# EAGLE schematic one-sided-keytile (EAGLE 9.5.1)
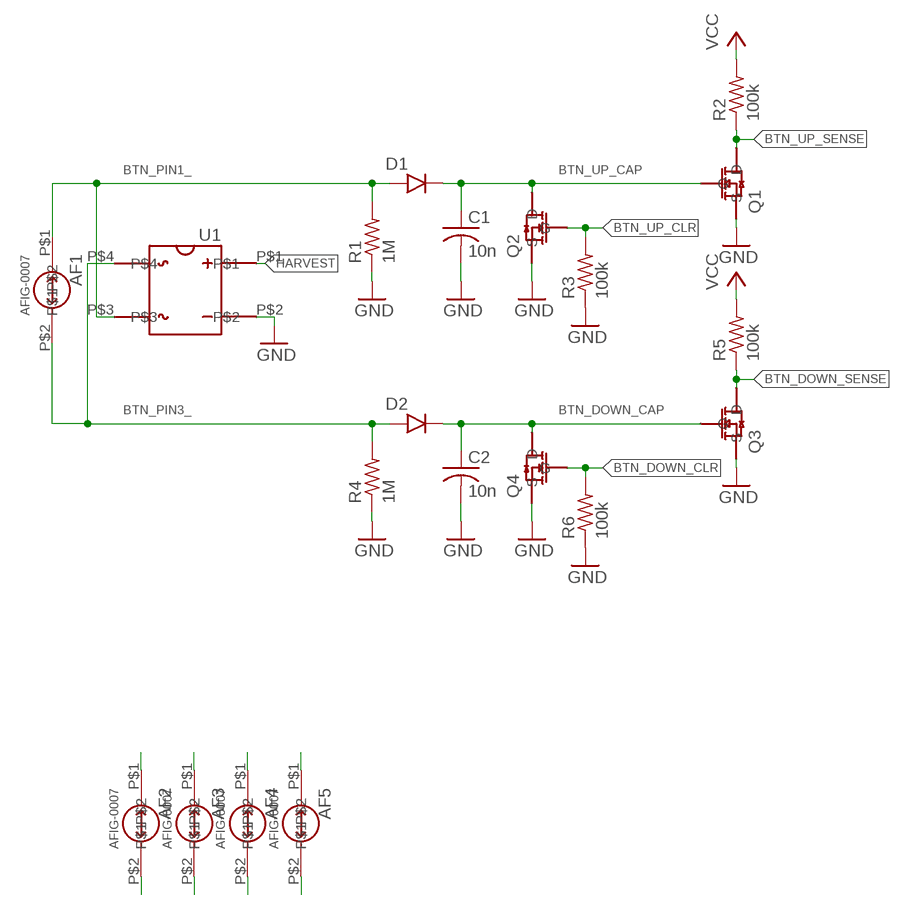
[diagram p0: schematic, sheet 1]

## Parts
AF1  BUTTON-MOUNT  [BUTTON-MOUNT]
AF2  BUTTON-MOUNT  [BUTTON-MOUNT]
AF3  BUTTON-MOUNT  [BUTTON-MOUNT]
AF4  BUTTON-MOUNT  [BUTTON-MOUNT]
AF5  BUTTON-MOUNT  [BUTTON-MOUNT]
C1  10n  C-USC0402  [C0402]
C2  10n  C-USC0402  [C0402]
D1  DFLU1200  [DFLU1200]
D2  DFLU1200  [DFLU1200]
Q1  2N7002K-7  [2N7002K-7]
Q2  BSS138K  [BSS138K]
Q3  2N7002K-7  [2N7002K-7]
Q4  BSS138K  [BSS138K]
R1  1M  R-US_R0402  [R0402]
R2  100k  R-US_R0402  [R0402]
R3  100k  R-US_R0402  [R0402]
R4  1M  R-US_R0402  [R0402]
R5  100k  R-US_R0402  [R0402]
R6  100k  R-US_R0402  [R0402]
U1  CDBHD140L-G  [CDBHDXX0L-G]

## Nets
BTN_DOWN_CAP: C2.1 D2.K Q3.G Q4.D
BTN_DOWN_CLR: Q4.G R6.2
BTN_DOWN_SENSE: Q3.D R5.1
BTN_PIN1_: AF1.P$1 D1.A R1.2 U1.P$3
BTN_PIN1_1: AF2.P$1
BTN_PIN1_2: AF3.P$1
BTN_PIN1_3: AF4.P$1
BTN_PIN1_4: AF5.P$1
BTN_PIN3_: AF1.P$2 D2.A R4.2 U1.P$4
BTN_PIN3_1: AF2.P$2
BTN_PIN3_2: AF3.P$2
BTN_PIN3_3: AF4.P$2
BTN_PIN3_4: AF5.P$2
BTN_UP_CAP: C1.1 D1.K Q1.G Q2.D
BTN_UP_CLR: Q2.G R3.2
BTN_UP_SENSE: Q1.D R2.1
GND: C1.2 C2.2 Q1.S Q2.S Q3.S Q4.S R1.1 R3.1 R4.1 R6.1 U1.P$2
HARVEST: U1.P$1
VCC: R2.2 R5.2

## Library data of the parts
AF1-AF5 = afig-0007:BUTTON-MOUNT
C1 C2 = rcl:C-US: CAPACITOR, American symbol; SPICEPREFIX: C
D1 D2 = afig-0007:DFLU1200
Q1 Q3 = afig-0007:2N7002K-7
Q2 Q4 = afig-0007:BSS138K
R1-R6 = rcl:R-US_: RESISTOR, American symbol; SPICEPREFIX: R
U1 = afig-0007:CDBHD140L-G